# Altium schematic sheet stm8s003f3.SchDoc
size A4
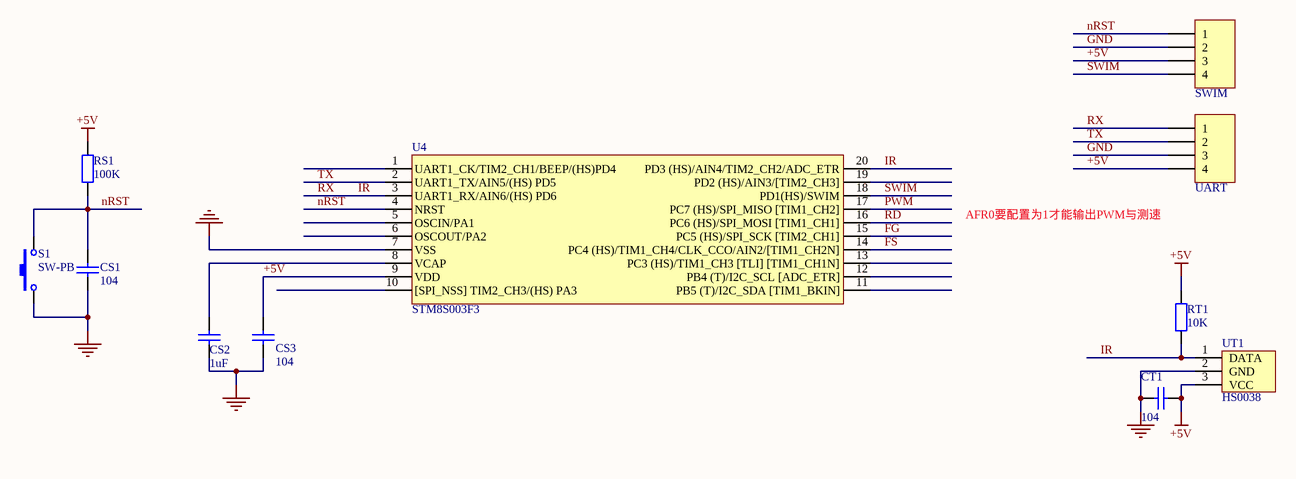
[diagram p0: stm8s003f3.SchDoc]

## Parts
CS1  value 104  [CAPC1608N]  (hidden comment: Cap1)
CS2  value 1uF  [CAPC1608N]  (hidden comment: Cap1)
CS3  value 104  [CAPC1608N]  (hidden comment: Cap1)
CT1  value 104  [CAPC1608N]  (hidden comment: Cap1)
RS1  value 100K  [RESC1608N]  (hidden comment: Res1)
RT1  value 10K  [RESC1608N]  (hidden comment: Res1)
S1  SW-PB  [SW-3x6]
SWIM  Header 4  [HDR1X4]  (value not drawn)
U4  STM8S003F3  [TSSOP20_N]
UART  Header 4  [HDR1X4]  (value not drawn)
UT1  HS0038  [HS0038]

## Nets
+5V: CS3.2 CT1.1 RS1.2 RT1.1 SWIM.3 U4.9(VDD) UART.4 UT1.3(VCC)
GND: CS1.1 CS2.1 CS3.1 CT1.2 S1.1 SWIM.2 U4.7(VSS) UART.3 UT1.2(GND)
FG: U4.15(PC5_(HS)/SPI_SCK_[TIM2_CH1])
FS: U4.14(PC4_(HS)/TIM1_CH4/CLK_CCO/AIN2/[TIM1_CH2N])
IR: RT1.2 U4.3(UART1_RX/AIN6/(HS)_PD6) U4.20(PD3_(HS)/AIN4/TIM2_CH2/ADC_ETR) UART.1 UT1.1(DATA)  [also labelled RX]
nRST: CS1.2 RS1.1 S1.2 SWIM.1 U4.4(NRST)
PWM: U4.17(PC7_(HS)/SPI_MISO_[TIM1_CH2])
RD: U4.16(PC6_(HS)/SPI_MOSI_[TIM1_CH1])
SWIM: SWIM.4 U4.18(PD1(HS)/SWIM)
TX: U4.2(UART1_TX/AIN5/(HS)_PD5) UART.2
NetCS2_2: CS2.2 U4.8(VCAP)

Not connected (* = marked no-connect by the designer): U4 1(UART1_CK/TIM2_CH1/BEEP/(HS)PD4) 5(OSCIN/PA1) 6(OSCOUT/PA2) 10([SPI_NSS]_TIM2_CH3/(HS)_PA3) 11(PB5_(T)/I2C_SDA_[TIM1_BKIN]) 12(PB4_(T)/I2C_SCL_[ADC_ETR]) 13(PC3_(HS)/TIM1_CH3_[TLI]_[TIM1_CH1N]) 19(PD2_(HS)/AIN3/[TIM2_CH3])

## Notes on the sheet
- AFR0要配置为1才能输出PWM与测速

## Library data of the parts
CS1-CS3 CT1 = Cap1: Capacitor; Published: 8-Jun-2000; LatestRevisionDate: 17-Jul-2002; LatestRevisionNote: Re-released for DXP Platform.; PackageReference: RAD-0.3; Publisher: Altium Limited
RS1 RT1 = Res1: Resistor; Published: 8-Jun-2000; LatestRevisionDate: 17-Jul-2002; LatestRevisionNote: Re-released for DXP Platform.; PackageReference: AXIAL-0.4; Publisher: Altium Limited
S1 = SW-PB: Switch; Published: 24-Mar-1999; LatestRevisionDate: 17-Jul-2002; LatestRevisionNote: Re-released for DXP Platform.; PackageReference: SPST-2; Publisher: Altium Limited; PackageDescription: Switch; 2 Leads
SWIM UART = Header 4: Header, 4-Pin; LatestRevisionDate: 17-Jul-2002; LatestRevisionNote: Re-released for DXP Platform.; Publisher: Altium Limited